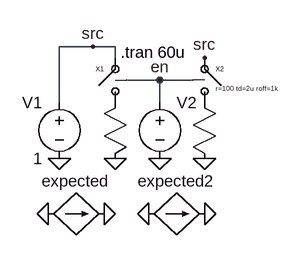
[diagram p0: schematic test-active_discharge.asc]
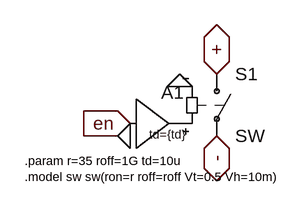
[diagram p1: sub-circuit active_discharge.asc]
test-active_discharge.asc, the LTspice schematic file:
Version 4
SHEET 1 880 680
WIRE 128 80 80 80
WIRE 160 80 128 80
WIRE 160 96 160 80
WIRE 224 128 176 128
WIRE 272 128 224 128
WIRE 80 160 80 80
WIRE 224 160 224 128
FLAG 160 240 0
FLAG 80 240 0
FLAG 224 240 0
FLAG 128 80 src
FLAG 224 128 en
FLAG 144 320 0
FLAG 64 320 0
FLAG 288 240 0
FLAG 288 96 src
FLAG 288 320 0
FLAG 208 320 0
SYMBOL active_discharge 160 160 M0
SYMATTR InstName X1
SYMBOL voltage 80 144 M0
SYMATTR InstName V1
SYMATTR Value 1
SYMBOL voltage 224 144 R0
WINDOW 3 24 96 Invisible 2
WINDOW 123 0 0 Left 0
WINDOW 39 0 0 Left 0
SYMATTR Value PULSE(0 1 20u 1n 1n 20u 40u 1)
SYMATTR InstName V2
SYMBOL bi 64 320 R270
WINDOW 0 32 40 VTop 2
WINDOW 3 -32 40 Invisible 2
SYMATTR InstName expected
SYMATTR Value I=IF(absdelay(V(en),10u),35,1G)
SYMATTR Value2 Rpar=1
SYMBOL active_discharge 288 160 R0
WINDOW 39 16 -20 Left 0
SYMATTR SpiceLine r=100 td=2u roff=1k
SYMATTR InstName X2
SYMBOL bi 208 320 R270
WINDOW 0 32 40 VTop 2
WINDOW 3 -32 40 Invisible 2
SYMATTR InstName expected2
SYMATTR Value I=IF(absdelay(V(en),2u),100,1k)
SYMATTR Value2 Rpar=1
TEXT 168 88 Left 2 !.tran 60u

active_discharge.asc, the sub-circuit schematic file:
Version 4
SHEET 1 880 680
FLAG 144 112 +
IOPIN 144 112 BiDir
FLAG 96 128 0
FLAG 32 176 en
IOPIN 32 176 In
FLAG 32 192 0
FLAG 144 192 -
IOPIN 144 192 BiDir
SYMBOL sw 144 96 R0
SYMATTR InstName S1
SYMBOL Digital\\buf1 32 112 R0
WINDOW 3 25 78 Left 1
SYMATTR Value td={td}
SYMATTR InstName A1
TEXT -104 224 Left 1 !.param r=35 roff=1G td=10u\n.model sw sw(ron=r roff=roff Vt=0.5 Vh=10m)

The netlist it stands for:
* test-active_discharge.asc
XX1 en src 0 active_discharge
V1 src 0 1
V2 en 0 PULSE(0 1 20u 1n 1n 20u 40u 1)
B§expected 0 0 I=IF(absdelay(V(en),10u),35,1G) Rpar=1
XX2 en src 0 active_discharge params: r=100 td=2u roff=1k
B§expected2 0 0 I=IF(absdelay(V(en),2u),100,1k) Rpar=1

* block symbol definitions
.subckt active_discharge en + -
S1 + - P001 0 SW
A1 en 0 0 0 0 0 P001 0 BUF td={td}
.param r=35 roff=1G td=10u
.model sw sw(ron=r roff=roff Vt=0.5 Vh=10m)
.ends active_discharge

.tran 60u
.backanno
.end